# EAGLE design keg-vol-weight-mon (EAGLE 9.6.2)
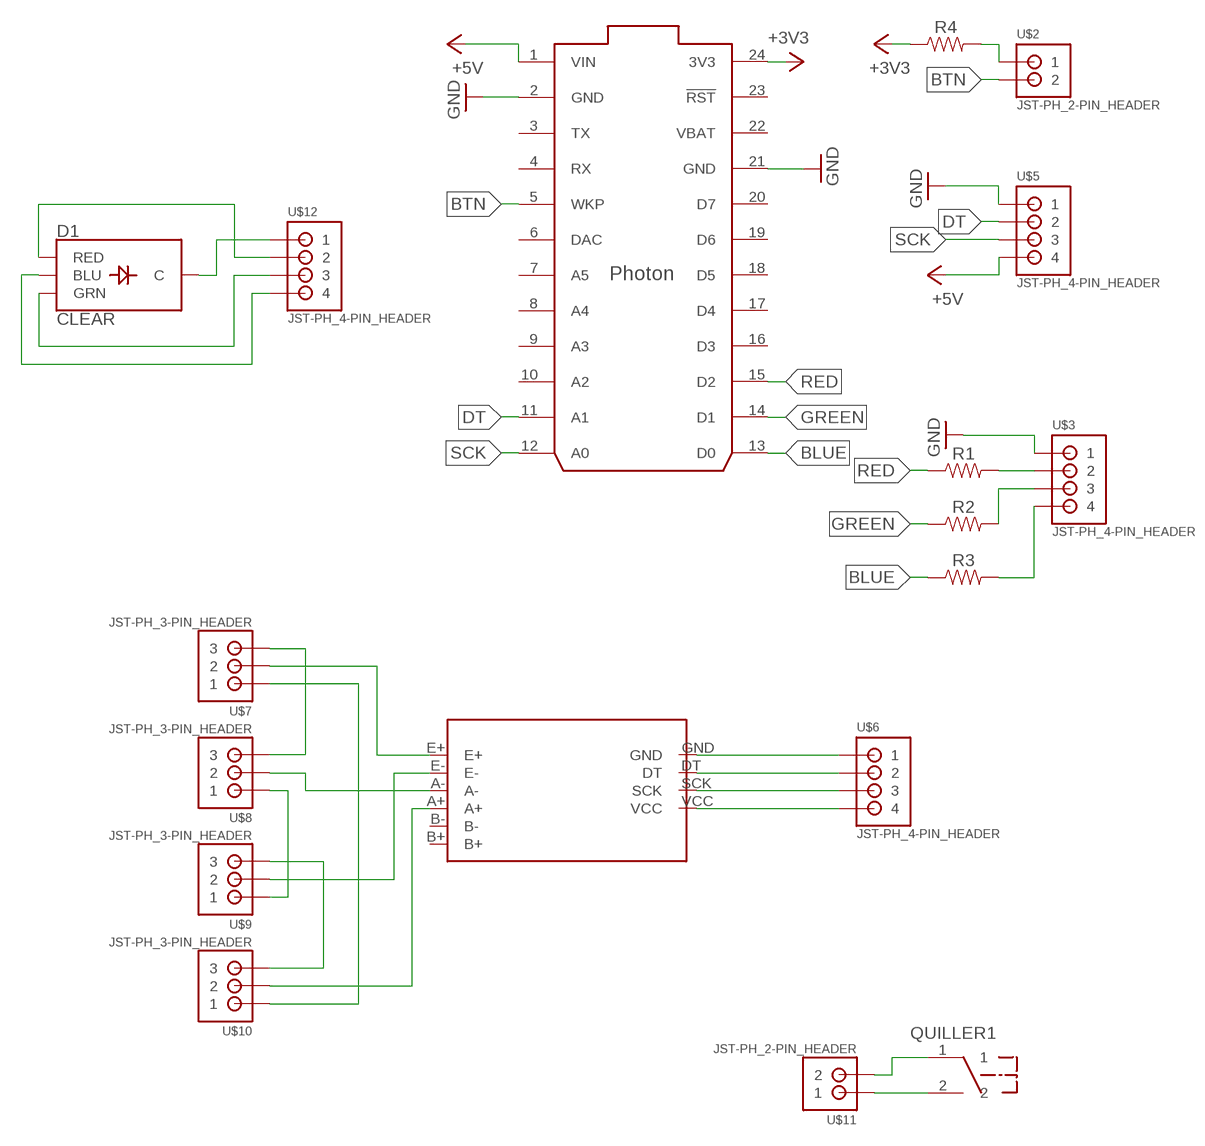
[diagram p0: schematic, sheet 1]

## Parts
D1  CLEAR  LED-RGB-CCCLEAR  [LED-RGB-THRU]
QUILLER1  6MM-2PIN-TAC-MOM-SWITCH  [6MM-2PIN-TAC-MOM-SWITCH]
R1  RESISTORAXIAL-0.3  [AXIAL-0.3]
R2  RESISTORAXIAL-0.3  [AXIAL-0.3]
R3  RESISTORAXIAL-0.3  [AXIAL-0.3]
R4  RESISTORAXIAL-0.3  [AXIAL-0.3]
U$1  PHOTON_WITH_HEADERS  [PHOTON]
U$2  JST-PH_2-PIN_HEADER  [JST_B2B-PH_HEADER]
U$3  JST-PH_4-PIN_HEADER  [JST_B4B-PH_HEADER]
U$4  HX711A  [HX711]
U$5  JST-PH_4-PIN_HEADER  [JST_B4B-PH_HEADER]
U$6  JST-PH_4-PIN_HEADER  [JST_B4B-PH_HEADER]
U$7  JST-PH_3-PIN_HEADER  [JST_B3B-PH_HEADER]
U$8  JST-PH_3-PIN_HEADER  [JST_B3B-PH_HEADER]
U$9  JST-PH_3-PIN_HEADER  [JST_B3B-PH_HEADER]
U$10  JST-PH_3-PIN_HEADER  [JST_B3B-PH_HEADER]
U$11  JST-PH_2-PIN_HEADER  [JST_B2B-PH_HEADER]
U$12  JST-PH_4-PIN_HEADER  [JST_B4B-PH_HEADER]

## Nets
+3V3: R4.P$1 U$1.24(3V3)
+5V: U$1.1(VIN) U$5.P4
BLUE: R3.P$1 U$1.13(D0)
BTN: U$1.5(WKP) U$2.P2
DT: U$1.11(A1) U$5.P2
GND: U$1.2(GND) U$1.21(GND) U$3.P1 U$5.P1
GREEN: R2.P$1 U$1.14(D1)
N$1: R2.P$2 U$3.P3
N$2: R3.P$2 U$3.P4
N$4: R4.P$2 U$2.P1
N$5: U$4.E+ U$7.P2
N$6: R1.P$2 U$3.P2
N$9: U$4.A- U$8.P2
N$10: U$4.E- U$9.P2
N$11: U$4.A+ U$10.P2
N$12: U$7.P3 U$8.P3
N$13: U$8.P1 U$9.P1
N$14: U$9.P3 U$10.P3
N$15: U$7.P1 U$10.P1
N$16: U$4.GND U$6.P1
N$17: U$4.DT U$6.P2
N$18: U$4.SCK U$6.P3
N$19: U$4.VCC U$6.P4
N$20: QUILLER1.1 U$11.P2
N$21: QUILLER1.2 U$11.P1
N$22: D1.2(C) U$12.P1
N$24: D1.4(BLU) U$12.P4
N$25: D1.3(GRN) U$12.P3
N$26: D1.1(RED) U$12.P2
RED: R1.P$1 U$1.15(D2)
SCK: U$1.12(A0) U$5.P3
Unconnected: U$1.3(TX) U$1.4(RX) U$1.6(DAC) U$1.7(A5) U$1.8(A4) U$1.9(A3) U$1.10(A2) U$1.16(D3) U$1.17(D4) U$1.18(D5) U$1.19(D6) U$1.20(D7) U$1.23(!RST) U$4.B+ U$4.B-

## Power pins joined to a net without a drawn wire
VBAT: U$1.22(VBAT)

## Library data of the parts
D1 = SparkFun-LED:LED-RGB-CC: LED-RGB Common Cathode Packages: LED RGB-THRU LED_PIRANHA_5MM SparkFun Products: RGB Diffused Common Cathode- Diffuse <[https://www.sparkfun.com/products/9264]> RGB Diffused Common Cathode - Clear <[https://www.sparkfun.com/products/105]> LED-RGB 5mm Square (Piranha) <[https://www.sparkfun.com/products/11679]>; PROD_ID: DIO-08418
QUILLER1 = QUILLER:6MM-2PIN-TAC-MOM-SWITCH
R1-R4 = SparkFun-Resistors:RESISTOR: Generic Resistor Package
U$1 = Particle-Devices:PHOTON: Particle Photon Wi-Fi through-hole development board footprint Product datasheet: here <https://docs.particle.io/datasheets/photon-(wifi)/photon-datasheet/> Design files: here <https://github.com/particle-iot/photon> Github : Particle devices library <https://github.com/particle-iot/hardware-libraries/tree/master/Eagle>
U$2 U$11 = SRG:JST-PH_2-PIN_HEADER: 2-pin JST PH Shrouded Header, top entry P/N B2B-PH-K-S Mating connector PHR-2 Mating cable assembly: Sparkfun PRT-09914 <http://www.sparkfun.com/products/9914>
U$3 U$5 U$6 U$12 = SRG:JST-PH_4-PIN_HEADER: 4-pin JST PH Shrouded Header, top entry P/N B4B-PH-K-S Mating connector PHR-4 Mating cable assembly: Sparkfun PRT-09916 <http://www.sparkfun.com/products/9916>
U$4 = HX711:HX711
U$7-U$10 = SRG:JST-PH_3-PIN_HEADER: 3-pin JST PH Shrouded Header, top entry P/N B3B-PH-K-S Mating connector PHR-3

## Board
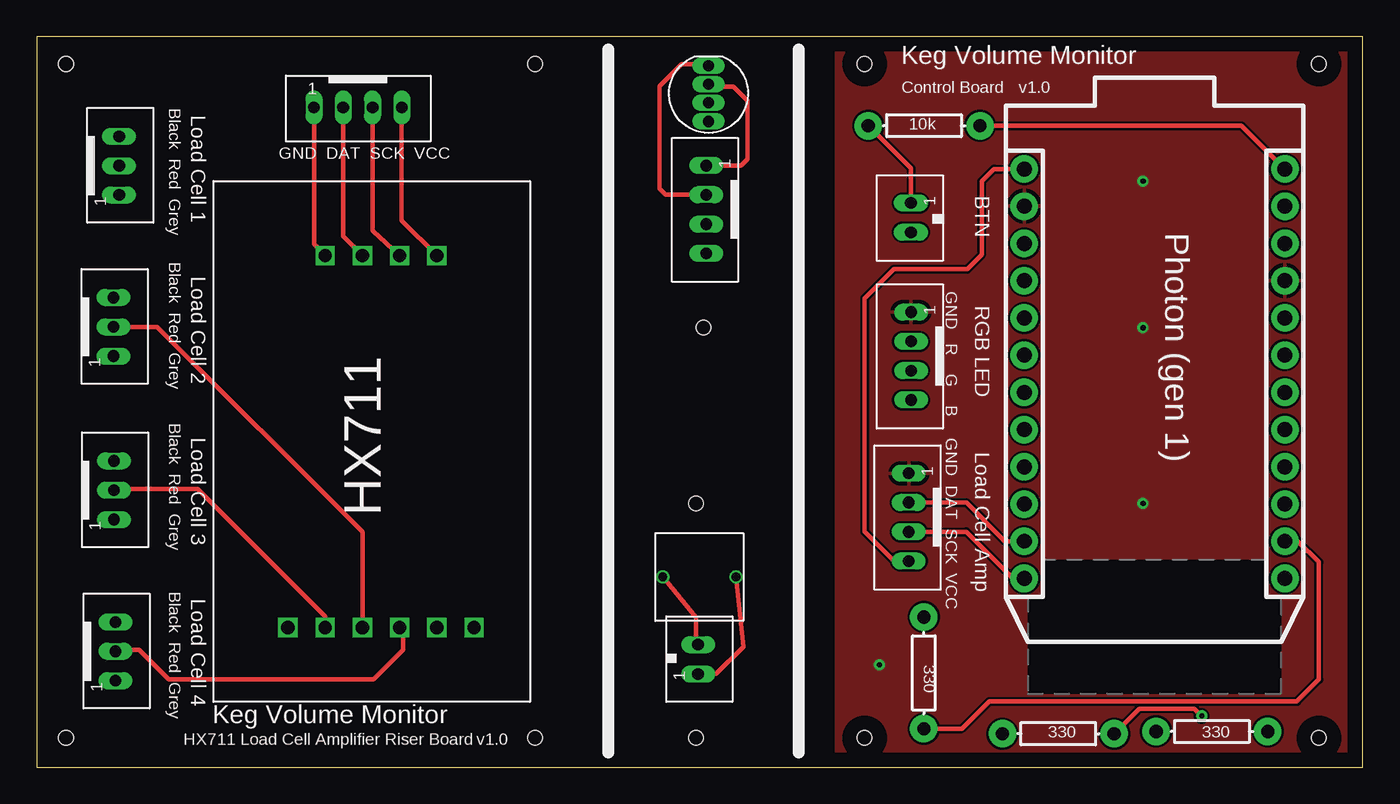
[diagram p1: board, top side]
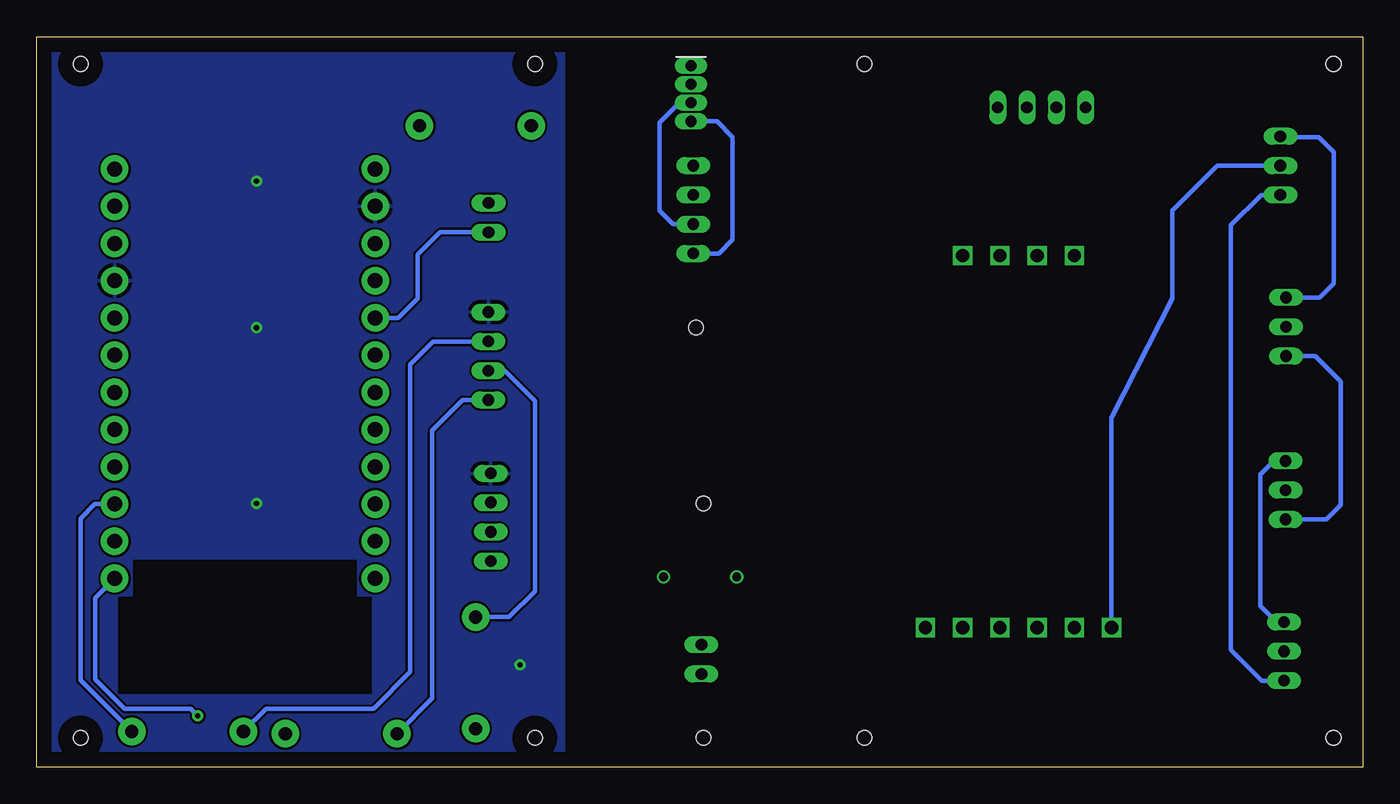
[diagram p2: board, bottom side, seen from below]

Size 90.5 x 49.87 mm. Coordinates in mm from the lower left corner, seen from the top.
Outline: 0,0 90.5,0 90.5,49.87 0,49.87 0,0
Copper layers (1*16): Top 0.035mm / dielectric 1.5mm / Bottom 0.035mm
Design rules "default *": minimum track width 6mil, minimum drill 0.35mm, track to track 6mil, track to pad 6mil, pad to pad 6mil, via to via 6mil, smd to smd 6mil, copper to edge 40mil, drill to drill 6mil, minimum pad ring 6mil, minimum via ring 8mil, stop-mask expansion 4mil, vias tented up to drill 0mil, thermal gap 10mil
Holes 1 mm at 2,48 34,48 34,2 2,2 56.5,48 87.5,48 87.5,2 56.5,2 45,2 45.5,30 45,18

### Footprints (pad centres in the part's own frame; a part is rotated, then mirrored left to right if it is on the bottom)
LED-RGB-THRU = drill 0.762 pad 0.889 long: 1 1.905,0; 2 0.635,0; 3 -0.635,0; 4 -1.905,0
6MM-2PIN-TAC-MOM-SWITCH = drill 0.6: 1 -2.5,0; 2 2.5,0
AXIAL-0.3 = drill 0.9 pad 1.88: P$1 -3.81,0; P$2 3.81,0
PHOTON = drill 1.016 pad 1.88: 1 1.27,33.02; 2 1.27,30.48; 3 1.27,27.94; 4 1.27,25.4; 5 1.27,22.86; 6 1.27,20.32; 7 1.27,17.78; 8 1.27,15.24; 9 1.27,12.7; 10 1.27,10.16; 11 1.27,7.62; 12 1.27,5.08; 13 19.05,5.08; 14 19.05,7.62; 15 19.05,10.16; 16 19.05,12.7; 17 19.05,15.24; 18 19.05,17.78; 19 19.05,20.32; 20 19.05,22.86; 21 19.05,25.4; 22 19.05,27.94; 23 19.05,30.48; 24 19.05,33.02
JST_B2B-PH_HEADER = drill 0.8 long: P1 1.075,0.048; P2 -0.925,0.048
JST_B4B-PH_HEADER = drill 0.8 long: P1 2.98,0.048; P2 0.98,0.048; P3 -1.02,0.048; P4 -3.02,0.048
HX711 = drill 0.9 square: A+ 5.08,8.89; A- 5.08,11.43; B+ 5.08,3.81; B- 5.08,6.35; DT 30.48,11.43; E+ 5.08,16.51; E- 5.08,13.97; GND 30.48,13.97; SCK 30.48,8.89; VCC 30.48,6.35
JST_B3B-PH_HEADER = drill 0.8 long: P1 2.027,0.048; P2 0.028,0.048; P3 -1.972,0.048

### Placement (x,y rotation side)
D1  45.85,45.99 90 top
QUILLER1  45.23,12.99 0 top
R1  80.2,2.44 180 top
R2  60.54,6.44 90 top
R3  69.72,2.29 180 top
R4  60.56,43.79 180 top
U$1  66.13,7.81 0 top
U$2  59.71,37.44 90 top
U$3  59.72,28.09 90 top
U$4  33.66,4.45 90 top
U$5  59.56,17.09 90 top
U$6  21.9,45.09 180 top
U$7  5.58,41.09 270 top
U$8  5.19,30.09 270 top
U$9  5.22,18.94 270 top
U$10  5.33,7.94 270 top
U$11  45.09,7.44 270 top
U$12  45.74,38.09 90 top

### Tracks (layer width: path | path; a pad name or v marks a point on that pad's centre or on a via)
+3V3
  Top 0.305: R4.P$1 82.22,43.79 U$1.24
+5V
  Top 0.305: U$5.P4 58.51,14.07 56.5,16.08 56.5,32 58.5,34 63.5,34 64.5,35 64.5,40 65.33,40.83 U$1.1
BLUE  (via drill 0.35)
  Top 0.305: R3.P$1 75.24,4 79,4 v79.5,3.5
  Bottom 0.305: v79.5,3.5 80,4 84.5,4 86.5,6 86.5,11.57 U$1.13
BTN
  Bottom 0.305: U$2.P2 62.98,36.52 64.5,35 64.5,32 65.83,30.67 U$1.5
DT
  Top 0.305: U$5.P2 63.43,18.07 66.07,15.43 U$1.11
GND  (via drill 0.35)
  other vias: 75.5,40 75.5,30 75.5,18 57.5,7
  pour Top: 54.5,52 54.5,-1 103,-1 103,51 102,52
  pour Bottom: 54.5,52 54.5,-1 90.5,-1 90.5,52
GREEN
  Top 0.305: R2.P$1 63.13,2.63 65,4.5 86,4.5 87.5,6 87.5,14 86.07,15.43 U$1.14
N$1
  Bottom 0.305: R2.P$2 58.25,10.25 56.5,12 56.5,25 58.57,27.07 U$3.P3
N$2
  Bottom 0.305: R3.P$2 63.5,4.7 63.5,23 61.43,25.07 U$3.P4
N$4
  Top 0.305: R4.P$2 59.66,40.88 U$2.P1
N$5
  Bottom 0.305: U$4.E+ 17.15,23.82 13,32 13,38 9.94,41.06 U$7.P2
N$6
  Bottom 0.305: R1.P$2 74.83,4 67.5,4 65,6.5 65,27.5 63.43,29.07 U$3.P2
N$9
  Top 0.305: U$4.A- 22.23,16.07 8.24,30.06 U$8.P2
N$10
  Top 0.305: U$4.E- 19.69,10.31 11,19 5.36,19 U$9.P2
N$11
  Top 0.305: U$4.A+ 25,9.3 25,8 23,6 9,6 7,8 5.46,8 U$10.P2
N$12
  Bottom 0.305: U$7.P3 5.57,43 3,43 2,42 2,33 2.94,32.06 U$8.P3
N$13
  Bottom 0.305: U$8.P1 3.24,28.06 1.5,26.32 1.5,17.91 2.5,16.91 U$9.P1
N$14
  Bottom 0.305: U$9.P3 6.09,20.91 7,20 7,11 5.91,9.91 U$10.P3
N$15
  Bottom 0.305: U$7.P1 6.94,39.06 9,37 9,8 6.91,5.91 U$10.P1
N$16
  Top 0.305: U$6.P1 18.92,35.7 U$4.GND
N$17
  Top 0.305: U$4.DT 20.92,36.24 U$6.P2
N$18
  Top 0.305: U$6.P3 22.92,36.61 U$4.SCK
N$19
  Top 0.305: U$4.VCC 24.92,37.32 U$6.P4
N$20
  Top 0.305: U$11.P2 45,8.5 45,10.22 QUILLER1.1
N$21
  Top 0.305: U$11.P1 46.37,6.37 48.23,8.23 QUILLER1.2
N$22
  Top 0.305: U$12.P1 48.07,41.07 48.5,41.5 48.5,45.5 47.55,46.45 46.02,46.45 D1.2
N$24
  Bottom 0.305: U$12.P4 43.93,35.07 43,36 43,43 44.09,44.09 D1.4
N$25
  Bottom 0.305: U$12.P3 47.07,37.07 48,38 48,44 46.65,45.35 D1.3
N$26
  Top 0.305: U$12.P2 42.93,39.07 42.5,39.5 42.5,46.5 44,48 45.74,48 D1.1
RED
  Bottom 0.305: R1.P$1 87.5,5.93 87.5,17 86.53,17.97 U$1.15
SCK
  Top 0.305: U$5.P3 63.43,16.07 66.61,12.89 U$1.12

### Text on the board
tPlace: Control Board | v1.0
tNames: Keg Volume Monitor | Black Red Grey | Load Cell 1 | 10k | GND DAT SCK VCC | BTN | Photon (gen 1) | Black Red Grey | Load Cell 2 | GND R G B | RGB LED | Black Red Grey | Load Cell 3 | GND DAT SCK VCC | Load Cell Amp | Black Red Grey | Load Cell 4 | 330 | Keg Volume Monitor | HX711 Load Cell Amplifier Riser Board | v1.0 | 330 | 330
tValues: B G R GND